# EAGLE design Controller Board v1 (EAGLE 5.06)
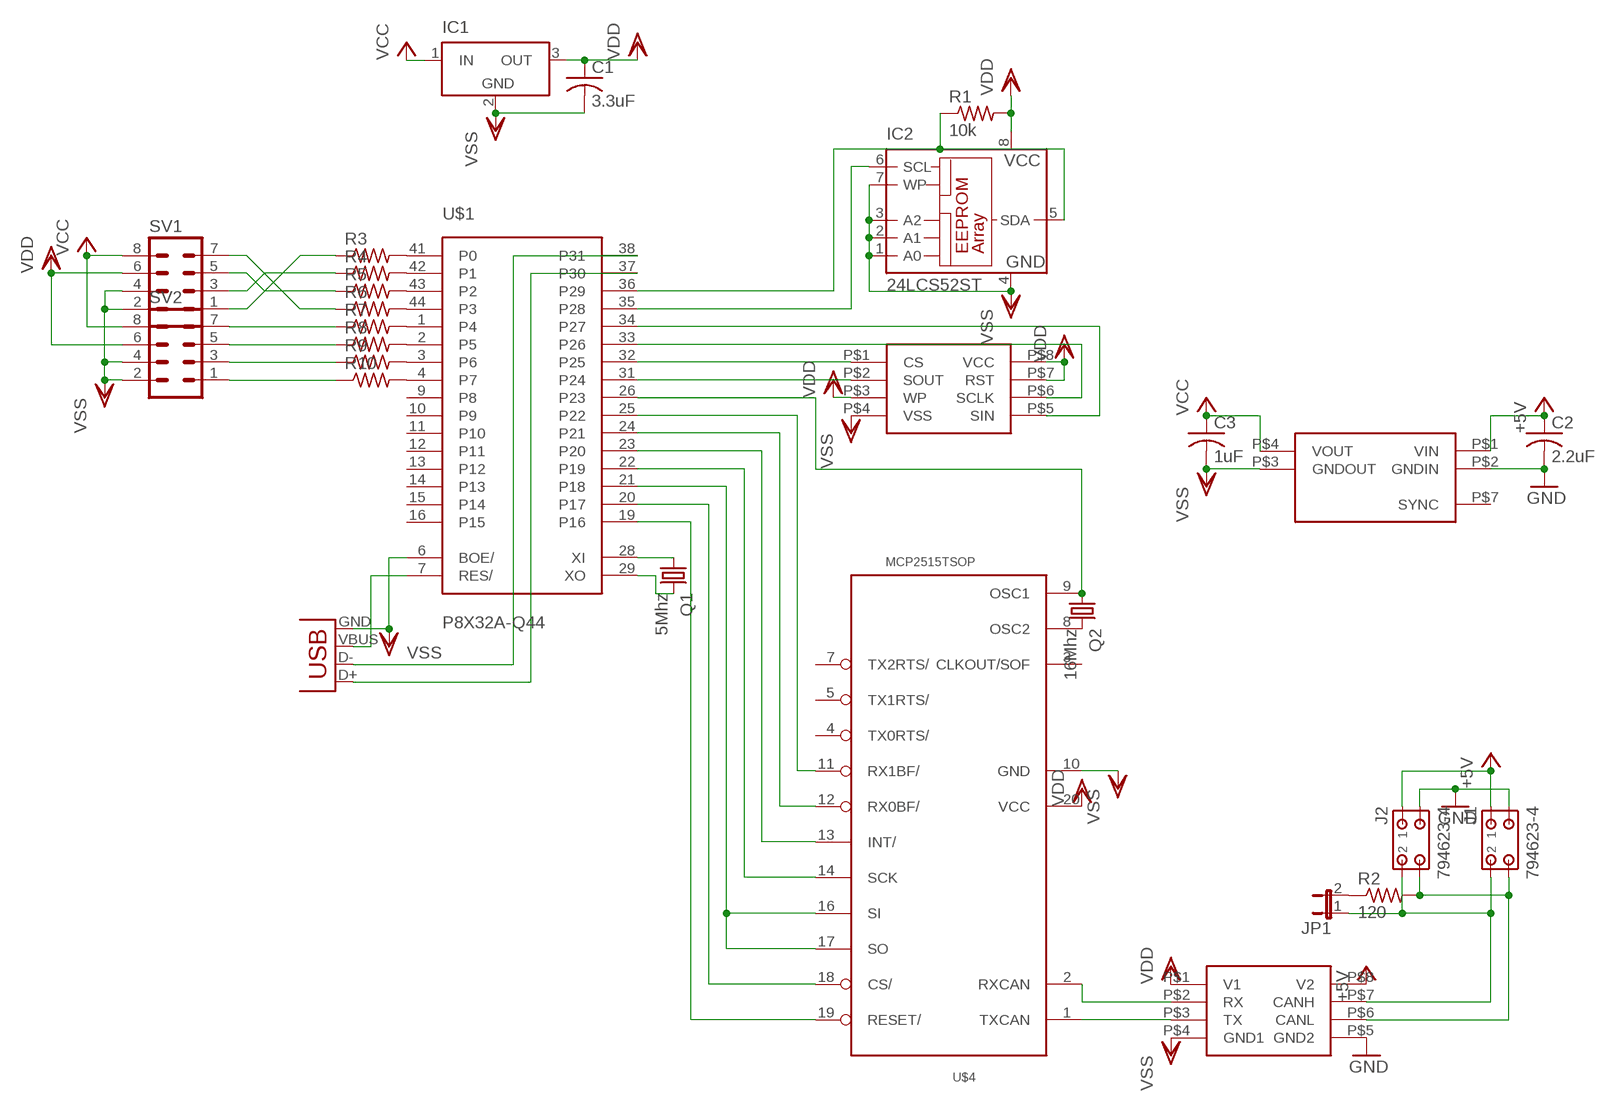
[diagram p0: schematic, sheet 1]

## Parts
C1  3.3uF  C-USC0805  [C0805]
C2  2.2uF  C-USC0805  [C0805]
C3  1uF  C-USC0805  [C0805]
IC1  LT1129CST5  [SOT223]
IC2  24LCS52ST  [TSSOP8]
J1  794623-4  [794623-4]
J2  794623-4  [794623-4]
JP1  JP1E  [JP1]
Q1  5Mhz  CRYSTALHC49UP  [HC49UP]
Q2  16Mhz  CRYSTALHC49UP  [HC49UP]
R1  10k  R-US_R0603  [R0603]
R2  120  R-US_R0603  [R0603]
R3  R-US_R0603  [R0603]
R4  R-US_R0603  [R0603]
R5  R-US_R0603  [R0603]
R6  R-US_R0603  [R0603]
R7  R-US_R0603  [R0603]
R8  R-US_R0603  [R0603]
R9  R-US_R0603  [R0603]
R10  R-US_R0603  [R0603]
SV1  MA04-2  [MA04-2]
SV2  MA04-2  [MA04-2]
U$1  P8X32A-Q44  [P8X32A-Q44]
U$2  TI-DCP020505  [PDIP14-7]
U$3  TI-ISO1050  [DUB-8]
U$4  MCP2515TSOP  [TSSOP20]
U$5  M25PE20  [S08N]
X1  USBSMD  [USB-MINIB]

## Nets
+5V: C2.1 J1.1 J2.1 U$2.P$1(VIN) U$3.P$8(V2)
GND: C2.2 J1.3 J2.3 U$2.P$2(GNDIN) U$3.P$5(GND2)
N$1: Q1.1 U$1.28(XI)
N$2: Q1.2 U$1.29(XO)
N$3: IC2.6(SCL) U$1.35(P28)
N$4: IC2.5(SDA) R1.1 U$1.36(P29)
N$5: U$1.7(RES/) X1.VBUS
N$6: U$1.38(P31) X1.D-
N$7: U$1.37(P30) X1.D+
N$8: U$1.25(P22) U$4.11(RX1BF/)
N$9: U$1.24(P21) U$4.12(RX0BF/)
N$10: J1.4 J2.4 R2.2 U$3.P$6(CANL)
N$11: J1.2 J2.2 JP1.1 U$3.P$7(CANH)
N$12: U$1.33(P26) U$5.P$6(SCLK)
N$13: U$1.34(P27) U$5.P$5(SIN)
N$14: U$1.32(P25) U$5.P$1(CS)
N$15: U$1.31(P24) U$5.P$2(SOUT)
N$16: U$1.23(P20) U$4.13(INT/)
N$17: U$1.22(P19) U$4.14(SCK)
N$18: Q2.1 U$1.26(P23) U$4.9(OSC1)
N$19: Q2.2 U$4.8(OSC2)
N$20: U$3.P$2(RX) U$4.2(RXCAN)
N$21: U$3.P$3(TX) U$4.1(TXCAN)
N$22: JP1.2 R2.1
N$23: U$1.21(P18) U$4.16(SI) U$4.17(SO)
N$24: U$1.20(P17) U$4.18(CS/)
N$25: U$1.19(P16) U$4.19(RESET/)
N$26: R3.2 U$1.41(P0)
N$27: R4.2 U$1.42(P1)
N$28: R5.2 U$1.43(P2)
N$29: R6.2 U$1.44(P3)
N$30: R7.2 U$1.1(P4)
N$31: R8.2 U$1.2(P5)
N$32: R9.2 U$1.3(P6)
N$33: R10.2 U$1.4(P7)
N$34: R6.1 SV1.7
N$35: R5.1 SV1.5
N$36: R4.1 SV1.3
N$37: R3.1 SV1.1
N$38: R7.1 SV2.7
N$39: R8.1 SV2.5
N$40: R9.1 SV2.3
N$41: R10.1 SV2.1
VCC: C3.1 IC1.1(IN) SV1.8 SV2.8 U$2.P$4(VOUT)
VDD: C1.1 IC1.3(OUT) IC2.8(VCC) R1.2 SV1.6 SV2.6 U$3.P$1(V1) U$4.20(VCC) U$5.P$3(WP) U$5.P$7(RST) U$5.P$8(VCC)
VSS: C1.2 C3.2 IC1.2(GND) IC2.1(A0) IC2.2(A1) IC2.3(A2) IC2.4(GND) IC2.7(WP) SV1.2 SV1.4 SV2.2 SV2.4 U$1.6(BOE/) U$2.P$3(GNDOUT) U$3.P$4(GND1) U$4.10(GND) U$5.P$4(VSS) X1.GND
Unconnected: U$1.9(P8) U$1.10(P9) U$1.11(P10) U$1.12(P11) U$1.13(P12) U$1.14(P13) U$1.15(P14) U$1.16(P15) U$2.P$7(SYNC) U$4.3(CLKOUT/SOF) U$4.4(TX0RTS/) U$4.5(TX1RTS/) U$4.7(TX2RTS/)

## Power pins joined to a net without a drawn wire
VDD: U$1.8(VDD) U$1.18(VDD) U$1.30(VDD) U$1.40(VDD)
VSS: IC1.4(GND) U$1.5(VSS) U$1.17(VSS) U$1.27(VSS) U$1.39(VSS)

## Library data of the parts
C1-C3 = rcl:C-US: CAPACITOR, American symbol
IC1 = linear-technology:LT1129CST5: VOLTAGE REGULATOR with shutdown
IC2 = microchip:24*: Serial EEPROM I2C
J1 J2 = con-amp:794623-4: MICRO MATE N LOK Dual Row, grid 1.5 mm Source: http://catalog.tycoelectronics.com .. ENG_CD_794623_F.pdf
JP1 = jumper:JP1E: JUMPER
Q1 Q2 = crystal:CRYSTAL: CRYSTAL
R1-R10 = rcl:R-US_: RESISTOR, American symbol
SV1 SV2 = con-lstb:MA04-2: PIN HEADER
U$1 = parallax_propeller:P8X32A-Q44
U$2 = isodcdc:TI-DCP020505
U$3 = isodcdc:TI-ISO1050
U$4 = MCP2515_MT:MCP2515*: MCP2515 Standalone CAN-Controller by Microchip Eagle-Lib. by MartinThomas
U$5 = Flash:M25PE20
X1 = SparkFun:USB: USB Connectors USB-B-PTH is fully proven SKU : PRT-00139 USB-miniB is fully proven SKU : PRT-00587 USB-A-PCB is untested. USB-A-H is throughly reviewed, but untested. Spark Fun Electronics SKU : PRT-00437 USB-B-SMT is throughly reviewed, but untested. Needs silkscreen touching up. USB-A-S has not been used/tested USB-MB-H has not been used/tested

## Board
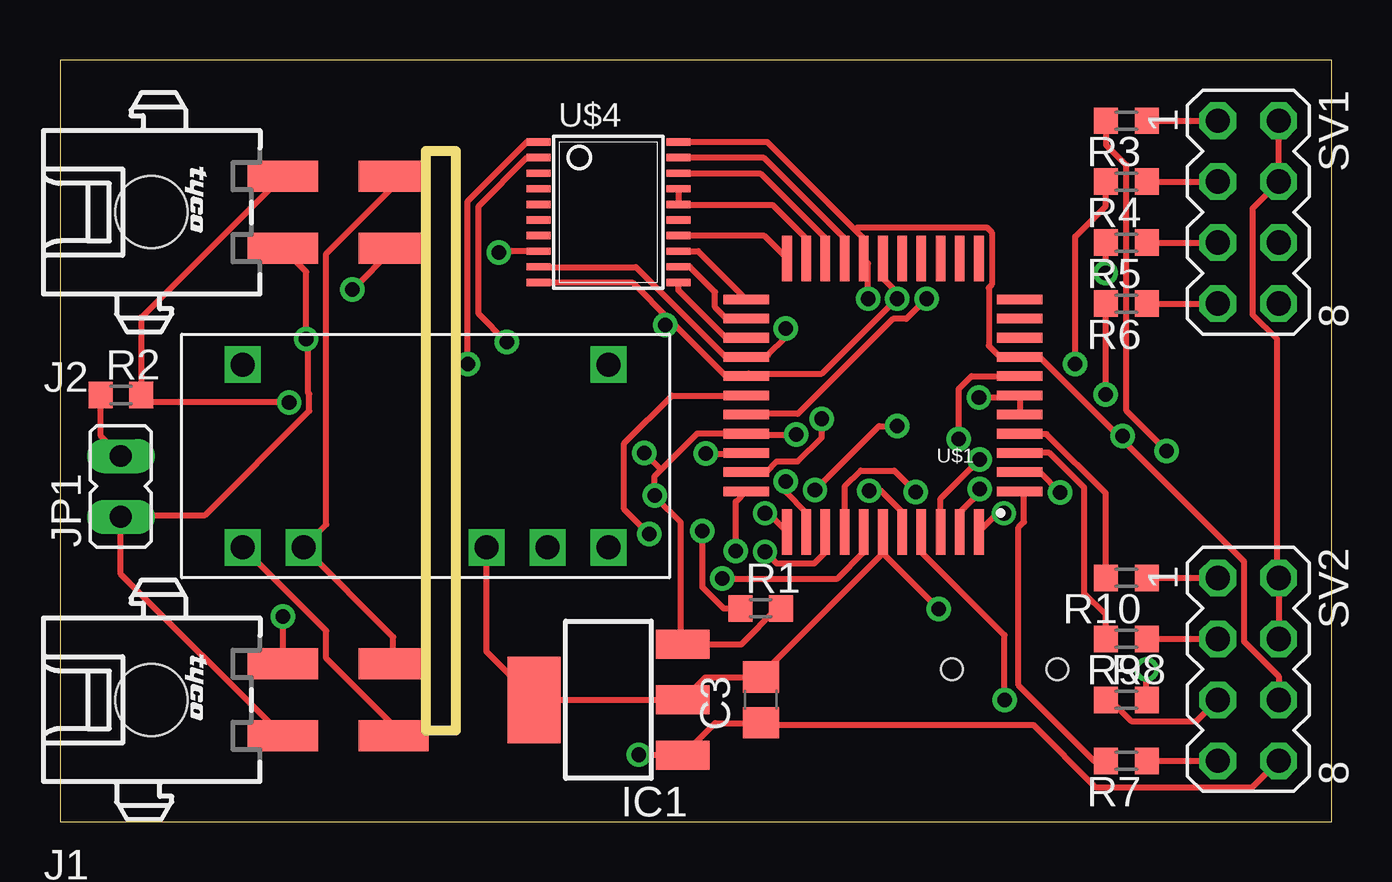
[diagram p1: board, top side]
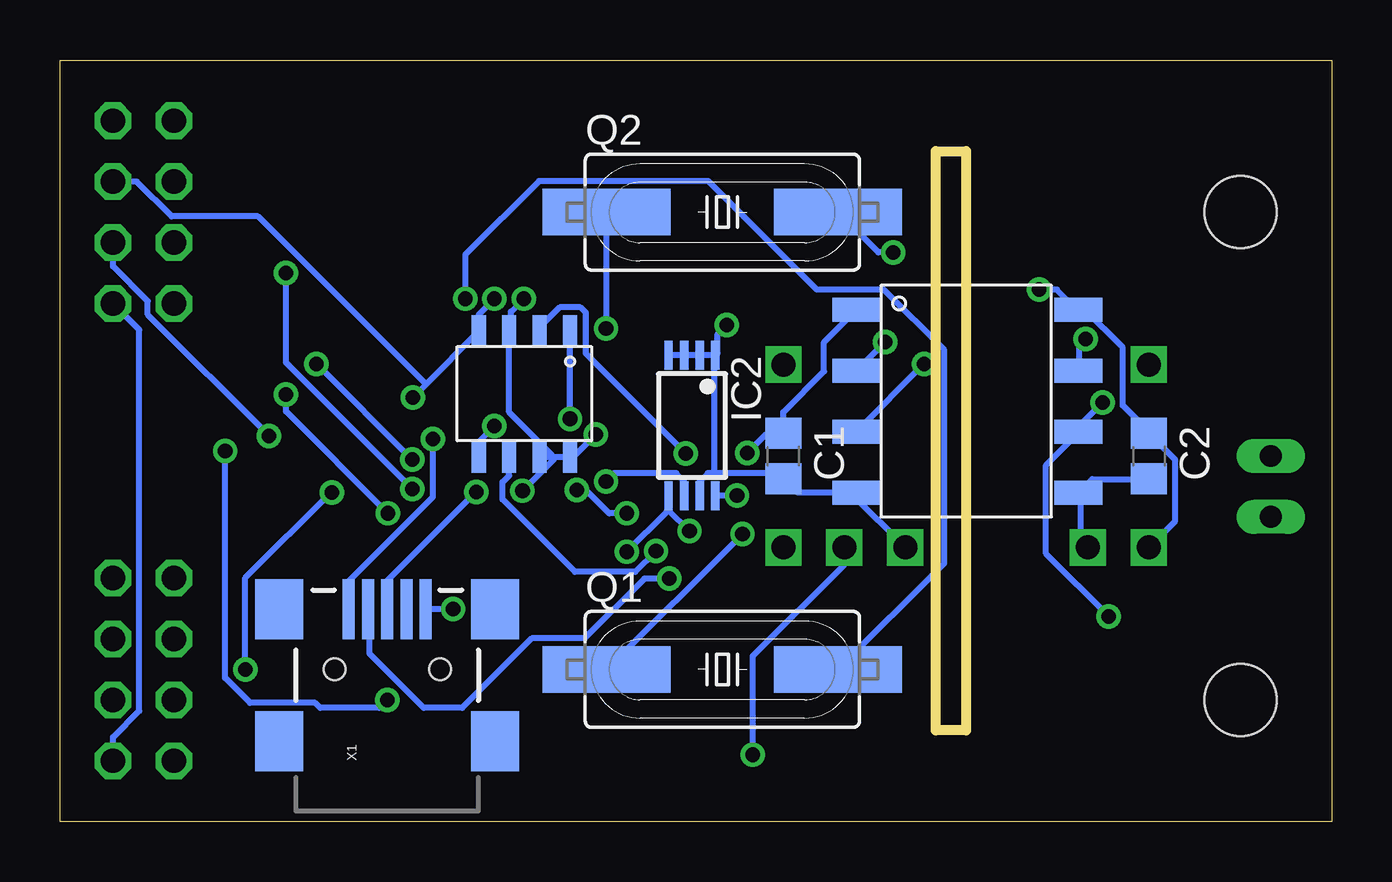
[diagram p2: board, bottom side, seen from below]

Size 53.01 x 31.74 mm. Coordinates in mm from the lower left corner, seen from the top.
Outline: 0,0 53.01,0 53.01,31.74 0,31.74 0,0
Copper layers (1*16): Top 0.035mm / dielectric 1.5mm / Bottom 0.035mm
Design rules "default": minimum track width 10mil, minimum drill 24mil, track to track 8mil, track to pad 8mil, pad to pad 8mil, via to via 8mil, smd to smd 8mil, copper to edge 40mil, drill to drill 8mil, minimum pad ring 10mil, minimum via ring 8mil, stop-mask expansion 4mil, vias tented up to drill 0mil, thermal gap 10mil
Milling: area 15.2,3.8 to 16.5,27.9

### Footprints (pad centres in the part's own frame; a part is rotated, then mirrored left to right if it is on the bottom)
C0805 = smd 1.3 x 1.5: 1 -0.95,0; 2 0.95,0
SOT223 = smd 1.219 x 2.235: 1 -2.311,-3.099; 2 0,-3.099; 3 2.311,-3.099 | smd 3.6 x 2.2: 4 0,3.099
TSSOP8 = smd 0.35 x 1.2: 1 -0.975,-2.925; 2 -0.325,-2.925; 3 0.325,-2.925; 4 0.975,-2.925; 5 0.975,2.925; 6 0.325,2.925; 7 -0.325,2.925; 8 -0.975,2.925
794623-4 = smd 1.3 x 2.92: 1 1.5,10.1; 2 1.5,5.48; 3 -1.5,10.1; 4 -1.5,5.48 | hole 3: 0,0
JP1 = drill 0.914 long: 1 0,-1.27; 2 0,1.27
HC49UP = smd 5.334 x 1.93: 1 -4.826,0; 2 4.826,0
R0603 = smd 1 x 1.1: 1 -0.85,0; 2 0.85,0
MA04-2 = drill 1.016 octagon: 1 -3.81,-1.27; 2 -3.81,1.27; 3 -1.27,-1.27; 4 -1.27,1.27; 5 1.27,-1.27; 6 1.27,1.27; 7 3.81,-1.27; 8 3.81,1.27
P8X32A-Q44 = smd 1.9 x 0.4: 1 -5.713,4.013; 2 -5.713,3.212; 3 -5.713,2.413; 4 -5.713,1.613; 5 -5.713,0.812; 6 -5.713,0.013; 7 -5.713,-0.787; 8 -5.713,-1.587; 9 -5.713,-2.388; 10 -5.713,-3.188; 11 -5.713,-3.987; 23 5.688,-3.987; 24 5.688,-3.188; 25 5.688,-2.388; 26 5.688,-1.587; 27 5.688,-0.787; 28 5.688,0.013; 29 5.688,0.812; 30 5.688,1.613; 31 5.688,2.413; 32 5.688,3.212; 33 5.688,4.013 | smd 0.4 x 1.9: 12 -4.013,-5.688; 13 -3.212,-5.688; 14 -2.413,-5.688; 15 -1.613,-5.688; 16 -0.812,-5.688; 17 -0.013,-5.688; 18 0.787,-5.688; 19 1.587,-5.688; 20 2.388,-5.688; 21 3.188,-5.688; 22 3.987,-5.688; 34 3.987,5.713; 35 3.188,5.713; 36 2.388,5.713; 37 1.587,5.713; 38 0.787,5.713; 39 -0.013,5.713; 40 -0.812,5.713; 41 -1.613,5.713; 42 -2.413,5.713; 43 -3.212,5.713; 44 -4.013,5.713
PDIP14-7 = drill 1 square: P$1 -8.89,-3.81; P$2 -6.35,-3.81; P$3 1.27,-3.81; P$4 3.81,-3.81; P$5 6.35,-3.81; P$6 6.35,3.81; P$7 -8.89,3.81
DUB-8 = smd 2 x 1: P$1 -4.572,3.556; P$2 -4.572,1.016; P$3 -4.572,-1.524; P$4 -4.572,-4.064; P$5 4.678,-4.064; P$6 4.678,-1.524; P$7 4.678,1.016; P$8 4.678,3.556
TSSOP20 = smd 0.305 x 0.991: 1 -2.925,-2.918; 2 -2.275,-2.918; 3 -1.625,-2.918; 4 -0.975,-2.918; 5 -0.325,-2.918; 6 0.325,-2.918; 7 0.975,-2.918; 8 1.625,-2.918; 9 2.275,-2.918; 10 2.925,-2.918; 11 2.925,2.918; 12 2.275,2.918; 13 1.625,2.918; 14 0.975,2.918; 15 0.325,2.918; 16 -0.325,2.918; 17 -0.975,2.918; 18 -1.625,2.918; 19 -2.275,2.918; 20 -2.925,2.918
S08N = smd 0.6 x 1.3: P$1 -2.54,-2.667; P$2 -1.27,-2.667; P$3 0,-2.667; P$4 1.27,-2.667; P$5 1.27,2.587; P$6 0,2.587; P$7 -1.27,2.587; P$8 -2.54,2.587
USB-MINIB = smd 2.5 x 0.5: D+ 2.5,0; D- 2.5,0.8; GND 2.5,-1.6; ID 2.5,-0.8; VBUS 2.5,1.6 | smd 2.5 x 2: GND@1 -3,-4.5; GND@2 -3,4.5; GND@3 2.5,4.5; GND@4 2.5,-4.5 | hole 0.9: 0,2.2; 0,-2.2

### Placement (x,y rotation side)
C1  22.86,15.24 270 bottom
C2  7.62,15.24 270 bottom
C3  29.21,5.08 90 top
IC1  22.86,5.08 90 top
IC2  26.67,16.51 180 bottom
J1  3.81,5.08 270 top
J2  3.81,25.4 270 top
JP1  2.54,13.97 0 top
Q1  25.4,6.35 0 bottom
Q2  25.4,25.4 0 bottom
R1  29.21,8.89 0 top
R2  2.54,17.78 0 top
R3  44.45,29.21 180 top
R4  44.45,26.67 180 top
R5  44.45,24.13 180 top
R6  44.45,21.59 180 top
R7  44.45,2.54 180 top
R8  44.45,5.08 0 top
R9  44.45,7.62 180 top
R10  44.45,10.16 180 top
SV1  49.53,25.4 270 top
SV2  49.53,6.35 270 top
U$1  34.29,17.78 180 top
U$2  16.51,15.24 0 top
U$3  15.24,17.78 0 bottom
U$4  22.86,25.4 270 top
U$5  34.29,17.78 180 bottom
X1  39.37,6.35 90 bottom

### Tracks (layer width: path | path; a pad name or v marks a point on that pad's centre or on a via)
+5V  (via drill 0.61)
  Top 0.254: U$2.P$1 11.1,7.95 11.1,6.81 13.89,4.01 13.89,3.58 J1.1 | v12.19,22.17 13.89,23.88 J2.1
  Bottom 0.254: U$2.P$1 6.53,12.52 6.53,15.09 C2.1 7.67,16.31 8.71,17.35 8.71,19.76 10.29,21.34 U$3.P$8 10.67,21.39 11.46,22.17 v12.19,22.17
GND
  Top 0.254: J1.3 13.89,6.6 13.89,7.7 U$2.P$2 10.24,11.53 11.1,12.39 11.1,23.67 13.89,26.47 13.89,26.9 J2.3
  Bottom 0.254: C2.2 7.62,14.28 9.98,14.28 10.54,13.72 U$3.P$5 10.46,13.61 10.46,11.73 U$2.P$2
N$1  (via drill 0.61)
  Top 0.254: v24.56,11.99 23.52,13.03 23.52,15.77 25.5,17.76 28.6,17.76 U$1.28
  Bottom 0.254: v24.56,11.99 30.2,6.35 Q1.1
N$2  (via drill 0.61)
  Top 0.254: v36.12,21.79 35.28,20.95 34.72,20.95 30.76,16.99 28.63,16.99 U$1.29
  Bottom 0.254: v36.12,21.79 36.12,23.62 33.05,26.7 25.98,26.7 21.46,22.17 18.67,22.17 16.15,19.66 16.15,10.77 Q1.2
N$3  (via drill 0.61)
  Top 0.254: v30.25,14.17 30.25,13.74 31.09,12.9 31.09,12.09 U$1.35
  Bottom 0.254: v30.25,14.17 29.9,14.53 27.33,14.53 27,14.2 IC2.6
N$4  (via drill 0.61)
  Top 0.254: v26.77,12.12 26.77,9.78 27.66,8.89 R1.1 | v29.39,11.25 29.87,10.77 31.45,10.77 31.9,11.23 U$1.36
  Bottom 0.254: v26.77,12.12 27.64,12.98 | 27.64,12.98 27.64,13.56 IC2.5 | v29.39,11.25 27.74,12.9 27.64,12.98
N$5  (via drill 0.61)
  Top 0.254: v37.47,15.95 37.47,18.03 38,18.57 39.98,18.57 U$1.7
  Bottom 0.254: v37.47,15.95 37.47,13.54 40.95,10.06 40.95,8.87 X1.VBUS
N$6  (via drill 0.61)
  Top 0.254: v27.61,10.13 32.41,10.13 33.48,11.2 33.48,12.06 U$1.38
  Bottom 0.254: v27.61,10.13 28.65,10.13 31.14,7.64 33.35,7.64 36.25,4.75 37.85,4.75 40.11,7.01 40.11,8.79 40.16,8.84 X1.D-
N$7  (via drill 0.61)
  Top 0.254: v35.66,13.74 34.77,14.63 33.38,14.63 32.72,13.97 32.72,12.09 U$1.37
  Bottom 0.254: v35.66,13.74 39.37,10.03 X1.D+
N$8
  Top 0.254: U$4.11 25.78,22.45 25.78,22.15 27.76,20.17 U$1.25
N$9
  Top 0.254: U$4.12 26.26,23.11 27.3,22.07 27.3,21.44 27.76,20.98 U$1.24
N$10  (via drill 0.61)
  Top 0.254: J2.4 9.27,26.9 3.4,21.03 3.4,17.78 R2.2 3.5,17.7 3.73,17.48 v9.55,17.48 | v9.3,8.56 9.3,6.6 J1.4
  Bottom 0.254: v9.55,17.48 10.54,16.48 10.54,16.26 U$3.P$6 10.62,16.15 11.91,14.86 11.91,11.18 v9.3,8.56
N$11  (via drill 0.61)
  Top 0.254: J2.2 9.3,23.88 10.26,22.91 v10.26,20.12 10.34,20.02 10.34,17.88 10.39,17.83 10.39,17.12 6.04,12.78 2.64,12.78 JP1.1 2.54,10.31 9.27,3.58 J1.2
  Bottom 0.254: v10.26,20.12 10.54,19.84 10.54,18.8 U$3.P$7
N$12  (via drill 0.61)
  Top 0.254: v28.17,11.28 28.17,13.33 U$1.33
  Bottom 0.254: v28.17,11.28 29.03,10.41 31.55,10.41 34.57,13.44 34.57,14.15 34.29,14.43 U$5.P$6
N$13  (via drill 0.61)
  Top 0.254: v34.9,16.48 34.14,16.48 v31.47,13.82 | v29.39,12.85 29.54,12.85 30.3,12.09 U$1.34
  Bottom 0.254: v34.9,16.48 35.56,15.82 U$5.P$5 | v31.47,13.82 31.09,13.82 30.12,12.85 v29.39,12.85
N$14  (via drill 0.61)
  Top 0.254: v31.75,16.79 31.75,16 30.76,15.01 29.87,15.01 29.44,14.58 28.63,14.58 U$1.32
  Bottom 0.254: v31.75,16.79 U$5.P$1
N$15  (via drill 0.61)
  Top 0.254: v26.92,15.34 28.57,15.34 U$1.31
  Bottom 0.254: U$5.P$2 33.02,20.6 32.18,21.44 31.32,21.44 31.09,21.21 31.09,19.51 v26.92,15.34
N$16
  Top 0.254: U$4.13 26.59,23.77 U$1.23
N$17
  Top 0.254: U$4.14 25.78,24.41 29.36,24.41 U$1.22
N$18  (via drill 0.61)
  Top 0.254: U$4.9 19.96,23.11 24,23.11 27.74,19.38 U$1.26 28.7,19.46 29.52,19.46 30.25,20.19 v30.25,20.55
  Bottom 0.254: Q2.1 30.23,20.57 v30.25,20.55
N$19  (via drill 0.61)
  Top 0.254: v18.29,23.72 18.34,23.77 U$4.8
  Bottom 0.254: v18.29,23.72 18.9,23.72 Q2.2
N$20  (via drill 0.61)
  Top 0.254: v18.62,19.99 17.45,21.16 17.45,25.65 19.46,27.66 U$4.2
  Bottom 0.254: U$3.P$2 v18.62,19.99
N$21  (via drill 0.61)
  Top 0.254: v16.99,19.08 16.99,25.86 19.46,28.32 U$4.1
  Bottom 0.254: U$3.P$3 v16.99,19.08
N$22
  Top 0.254: JP1.2 1.7,16.08 1.7,17.78 R2.1
N$23
  Top 0.254: U$4.17 U$4.16 25.91,25.7 29.69,25.7 31.09,24.31 U$1.21
N$24
  Top 0.254: U$4.18 25.78,27 29.21,27 31.9,24.31 U$1.20
N$25
  Top 0.254: U$4.19 29.34,27.66 32.69,24.31 U$1.19
N$26  (via drill 0.61)
  Top 0.254: v46.13,15.44 44.45,17.12 44.45,27.36 43.61,28.19 43.61,29.21 R3.2 | v39.37,5.08 39.37,7.77 35.92,11.23 35.92,12.06 U$1.41
  Bottom 0.254: v46.13,15.44 46.13,5.99 45.09,4.95 42.37,4.95 42.16,4.75 39.7,4.75 v39.37,5.08
N$27  (via drill 0.61)
  Top 0.254: v42.32,19.08 42.32,24.38 43.59,25.65 43.59,26.67 R4.2 | v38.33,15.09 36.7,13.46 36.7,12.09 U$1.42
  Bottom 0.254: v38.33,15.09 v42.32,19.08
N$28  (via drill 0.61)
  Top 0.254: v43.59,22.86 43.59,24.13 R5.2 | v38.33,13.87 38.33,13.72 37.52,12.9 37.52,12.09 U$1.43
  Bottom 0.254: v43.59,22.86 43.59,19.13 v38.33,13.87
N$29  (via drill 0.61)
  Top 0.254: v43.59,17.8 43.59,21.59 R6.2 | v39.34,12.85 39.06,12.85 38.3,12.09 U$1.44
  Bottom 0.254: v43.59,17.8 43.59,17.09 v39.34,12.85
N$30
  Top 0.254: R7.2 43.1,2.54 39.95,5.69 39.95,12.27 40.18,12.5 40.18,13.59 U$1.1
N$31  (via drill 0.61)
  Top 0.254: v45.29,6.35 45.29,5.08 R8.2 | v41.68,13.72 40.84,14.55 40.01,14.55 U$1.2
  Bottom 0.254: v45.29,6.35 45.29,10.16 41.73,13.72 v41.68,13.72
N$32
  Top 0.254: R9.2 43.59,7.62 43.59,8.64 42.7,9.53 42.7,13.92 41.25,15.37 U$1.3
N$33
  Top 0.254: R10.2 43.59,10.16 43.59,13.69 41.12,16.15 40.01,16.15 U$1.4
N$34
  Top 0.254: R6.1 SV1.7
N$35
  Top 0.254: R5.1 SV1.5
N$36
  Top 0.254: R4.1 SV1.3
N$37
  Top 0.254: R3.1 SV1.1
N$38
  Top 0.254: R7.1 SV2.7
N$39
  Top 0.254: SV2.5 47.37,4.19 44.65,4.19 43.76,5.08 R8.1
N$40
  Top 0.254: R9.1 SV2.3
N$41
  Top 0.254: R10.1 SV2.1
VCC  (via drill 0.61)
  Top 0.254: v24.13,2.79 25.86,2.79 IC1.1 27.3,4.12 29.21,4.12 C3.1 29.31,4.04 40.56,4.04 43.16,1.45 49.71,1.45 SV2.8
  Bottom 0.254: U$2.P$4 20.32,10.72 24.13,6.91 v24.13,2.79 | SV2.8 50.8,3.53 49.71,4.62 49.71,20.5 SV1.8
VDD  (via drill 0.61)
  Top 0.254: R1.2 29.9,8.89 28.4,7.39 IC1.3 25.88,7.49 25.88,12.47 24.87,13.49 v24.79,13.59 24.79,14.4 25.06,14.67 | 25.06,14.67 26.57,16.18 U$1.30 28.73,16.13 v30.68,16.13 | 25.06,14.67 v24.36,15.37 | v33.73,13.79 34.21,13.79 35.08,12.93 35.08,12.09 U$1.40 | 33.13,24.68 33.48,24.33 33.48,23.47 U$1.18 33.58,23.37 33.68,23.27 v33.68,21.79 | 33.13,24.68 29.49,28.32 U$4.20 | 33.13,24.68 33.22,24.77 38.63,24.77 38.84,24.56 38.84,22.38 38.71,22.25 38.71,19.84 39.17,19.38 39.98,19.38 U$1.8 40.13,19.36 40.84,19.36 44.21,15.99 | SV2.6 50.8,6.07 49.35,7.52 49.35,10.85 44.21,15.99 | 44.21,15.99 v44.3,16.08
  Bottom 0.254: U$3.P$1 21.16,19.99 21.16,18.77 22.86,17.07 C1.1 22.96,16.13 23.6,16.13 v24.36,15.37 | v24.79,13.59 25.68,13.59 IC2.8 | 32.51,15.19 U$5.P$7 | 32.44,15.19 32.51,15.19 | 32.44,15.19 U$5.P$8 31.65,15.16 v30.68,16.13 | 32.51,15.19 32.51,15.29 34.29,17.07 U$5.P$3 34.21,20.55 34.21,21.26 v33.68,21.79 | v33.73,13.79 32.44,15.09 32.44,15.19 | SV1.6 50.8,23.14 49.35,21.69 49.35,21.13 v44.3,16.08
VSS  (via drill 0.61)
  Top 0.254: 34.29,11.18 U$1.39 | 34.29,11.18 29.26,6.15 C3.2 26.9,6.02 IC1.2 IC1.4 19.68,5.18 17.78,7.09 U$2.P$3 | v36.63,8.87 34.39,11.1 34.29,11.18 | SV2.4 SV2.2 50.72,10.26 50.72,20.12 49.71,21.13 49.71,25.55 50.72,26.57 SV1.4 SV1.2 | 25.43,20.9 27.74,18.59 28.6,18.59 U$1.27 28.7,18.67 31.75,18.67 34.8,21.72 v34.9,21.79 34.9,22.05 34.31,22.63 34.31,23.44 U$1.17 | 25.43,20.9 23.88,22.45 19.96,22.45 U$4.10 | U$1.5 40.01,16.99 40.01,17.76 U$1.6 39.9,17.68 v38.3,17.68 | v25.22,20.7 25.43,20.9
  Bottom 0.254: IC2.1 IC2.2 26.47,19.43 26.98,19.43 IC2.3 27.1,19.43 27.64,19.43 IC2.4 | 25.73,14.53 23.09,14.53 C1.2 22.76,14.22 22.25,13.72 U$3.P$4 19.96,13.61 U$2.P$3 | 25.73,14.53 26.01,14.53 26.34,14.2 IC2.7 | IC2.1 25.73,19.3 25.73,14.53 | v36.63,8.87 37.77,8.87 X1.GND | v34.9,21.79 35.56,21.13 U$5.P$4 35.64,20.34 37.76,18.22 | 37.76,18.22 v38.3,17.68 | SV1.4 49.81,26.67 48.36,25.22 44.76,25.22 37.76,18.22 | v25.22,20.7 25.6,20.32 25.6,19.53 IC2.1